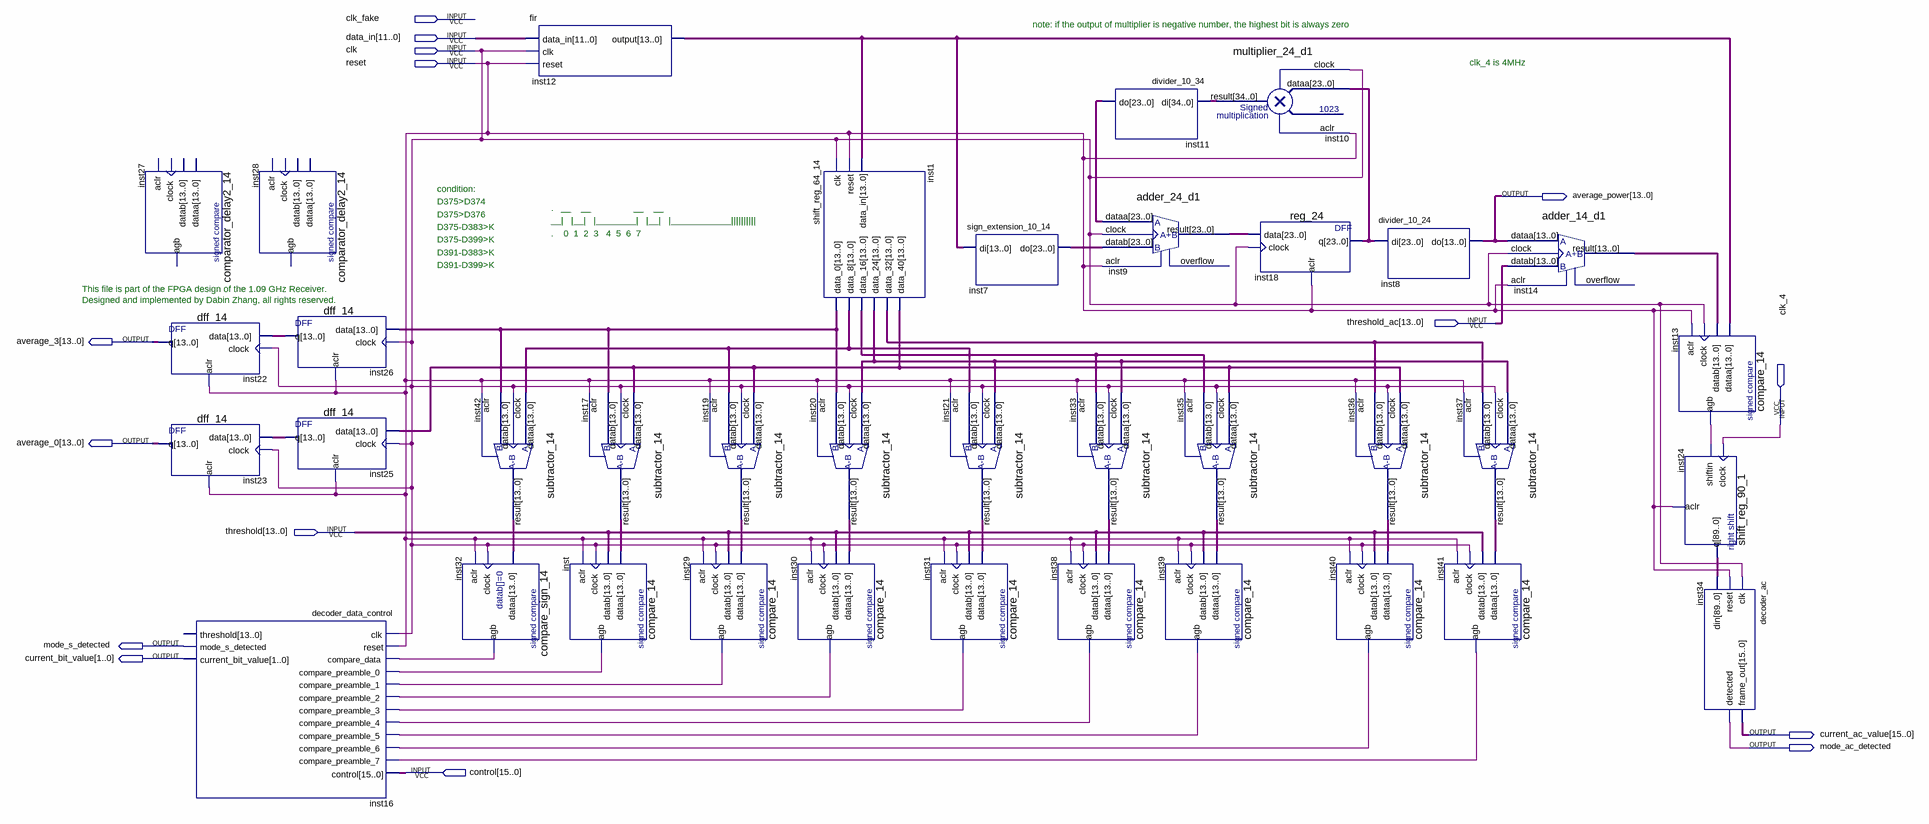
[diagram p0: schematic sheet]
// Quartus schematic decoder_data_process.bdf as structural Verilog: 37 symbols, 15 pins
module decoder_data_process (
  input  clk_fake,
  input  [11:0] data_in,
  input  clk,
  input  reset,
  input  [13:0] threshold_ac,
  input  clk_4,
  input  [13:0] threshold,
  input  [15:0] control,
  output [13:0] average_power,
  output [13:0] average_3,
  output [13:0] average_0,
  output mode_s_detected,
  output [1:0] current_bit_value,
  output [15:0] current_ac_value,
  output mode_ac_detected
);

  wire inst13_agb, inst29_agb, inst30_agb, inst31_agb, inst32_agb, inst38_agb, inst39_agb, inst40_agb,
       inst41_agb, inst_agb;
  wire [13:0] inst1_data_0, inst1_data_8, inst1_data_16, inst1_data_24, inst1_data_32, inst1_data_40,
       inst12_output, inst14_result, inst17_result, inst19_result, inst20_result, inst21_result, inst25_q,
       inst26_q, inst33_result, inst35_result, inst36_result, inst37_result, inst42_result;
  wire [23:0] inst7_do, inst9_result, inst11_do, inst18_q;
  wire [34:0] inst10_result;
  wire [89:0] inst24_q;

  comparator_delay2_14 inst27 ();  // open: dataa, datab, clock, aclr, agb
  dff_14 inst22 (.data(inst26_q), .clock(clk), .aclr(reset), .q(average_3));
  dff_14 inst23 (.data(inst25_q), .clock(clk), .aclr(reset), .q(average_0));
  decoder_data_control inst16 (
    .clk(clk), .reset(reset), .compare_data(inst32_agb), .compare_preamble_0(inst_agb),
    .compare_preamble_1(inst29_agb), .compare_preamble_2(inst30_agb), .compare_preamble_3(inst31_agb),
    .compare_preamble_4(inst38_agb), .compare_preamble_5(inst39_agb), .compare_preamble_6(inst40_agb),
    .compare_preamble_7(inst41_agb), .control(control), .mode_s_detected(mode_s_detected),
    .current_bit_value(current_bit_value));  // open: threshold
  comparator_delay2_14 inst28 ();  // open: dataa, datab, clock, aclr, agb
  dff_14 inst26 (.data(inst1_data_0), .clock(clk), .aclr(reset), .q(inst26_q));
  dff_14 inst25 (.data(inst1_data_40), .clock(clk), .aclr(reset), .q(inst25_q));
  subtractor_14 inst42 (.dataa(inst1_data_8), .datab(inst1_data_0), .clock(clk), .aclr(reset), .result(inst42_result));
  compare_sign_14 inst32 (.dataa(inst42_result), .clock(clk), .aclr(reset), .agb(inst32_agb));
  fir inst12 (.data_in(data_in), .clk(clk), .reset(reset), .\output (inst12_output));
  subtractor_14 inst17 (.dataa(inst1_data_40), .datab(inst1_data_0), .clock(clk), .aclr(reset), .result(inst17_result));
  compare_14 inst (.dataa(inst17_result), .datab(threshold), .clock(clk), .aclr(reset), .agb(inst_agb));
  compare_14 inst29 (.dataa(inst19_result), .datab(threshold), .clock(clk), .aclr(reset), .agb(inst29_agb));
  subtractor_14 inst19 (.dataa(inst1_data_40), .datab(inst1_data_8), .clock(clk), .aclr(reset), .result(inst19_result));
  shift_reg_64_14 inst1 (
    .clk(clk), .reset(reset), .data_in(inst12_output), .data_0(inst1_data_0), .data_8(inst1_data_8),
    .data_16(inst1_data_16), .data_24(inst1_data_24), .data_32(inst1_data_32), .data_40(inst1_data_40));
  subtractor_14 inst20 (.dataa(inst1_data_24), .datab(inst1_data_0), .clock(clk), .aclr(reset), .result(inst20_result));
  compare_14 inst30 (.dataa(inst20_result), .datab(threshold), .clock(clk), .aclr(reset), .agb(inst30_agb));
  compare_14 inst31 (.dataa(inst21_result), .datab(threshold), .clock(clk), .aclr(reset), .agb(inst31_agb));
  sign_extension_10_14 inst7 (.di(inst12_output), .\do (inst7_do));
  subtractor_14 inst21 (.dataa(inst1_data_24), .datab(inst1_data_8), .clock(clk), .aclr(reset), .result(inst21_result));
  subtractor_14 inst33 (
    .dataa(inst1_data_24), .datab(inst1_data_16), .clock(clk), .aclr(reset), .result(inst33_result));
  compare_14 inst38 (.dataa(inst33_result), .datab(threshold), .clock(clk), .aclr(reset), .agb(inst38_agb));
  divider_10_34 inst11 (.di(inst10_result), .\do (inst11_do));
  adder_24_d1 inst9 (
    .dataa(inst11_do), .datab(inst7_do), .clock(clk), .aclr(reset), .result(inst9_result));  // open: overflow
  subtractor_14 inst35 (
    .dataa(inst1_data_40), .datab(inst1_data_16), .clock(clk), .aclr(reset), .result(inst35_result));
  compare_14 inst39 (.dataa(inst35_result), .datab(threshold), .clock(clk), .aclr(reset), .agb(inst39_agb));
  multiplier_24_d1 inst10 (.dataa(inst18_q), .clock(clk), .aclr(reset), .result(inst10_result));
  reg_24 inst18 (.data(inst9_result), .clock(clk), .aclr(reset), .q(inst18_q));
  compare_14 inst40 (.dataa(inst36_result), .datab(threshold), .clock(clk), .aclr(reset), .agb(inst40_agb));
  divider_10_24 inst8 (.di(inst18_q), .\do (average_power));
  subtractor_14 inst36 (
    .dataa(inst1_data_40), .datab(inst1_data_32), .clock(clk), .aclr(reset), .result(inst36_result));
  compare_14 inst41 (.dataa(inst37_result), .datab(threshold), .clock(clk), .aclr(reset), .agb(inst41_agb));
  subtractor_14 inst37 (
    .dataa(inst1_data_24), .datab(inst1_data_32), .clock(clk), .aclr(reset), .result(inst37_result));
  adder_14_d1 inst14 (
    .dataa(average_power), .datab(threshold_ac), .clock(clk), .aclr(reset), .result(inst14_result));  // open: overflow
  compare_14 inst13 (.dataa(inst12_output), .datab(inst14_result), .clock(clk), .aclr(reset), .agb(inst13_agb));
  shift_reg_90_1 inst24 (.clock(clk_4), .shiftin(inst13_agb), .aclr(reset), .q(inst24_q));
  decoder_ac inst34 (
    .clk(clk), .reset(reset), .din(inst24_q), .frame_out(current_ac_value), .detected(mode_ac_detected));

  // Notes on the sheet:
  //   note: if the output of multiplier is negative number, the highest bit is always zero
  //   clk_4 is 4MHz
  //   condition:
  //   D375>D374
  //   .   __    __                 __    __
  //   D375>D376
  //   __|   |__|   |________|   |__|   |____________||||||||||
  //   D375-D383>K
  //   .    0  1  2  3   4  5  6  7
  //   D375-D399>K
  //   D391-D383>K
  //   D391-D399>K
  //   This file is part of the FPGA design of the 1.09 GHz Receiver.
  //   Designed and implemented by Dabin Zhang, all rights reserved.
endmodule
